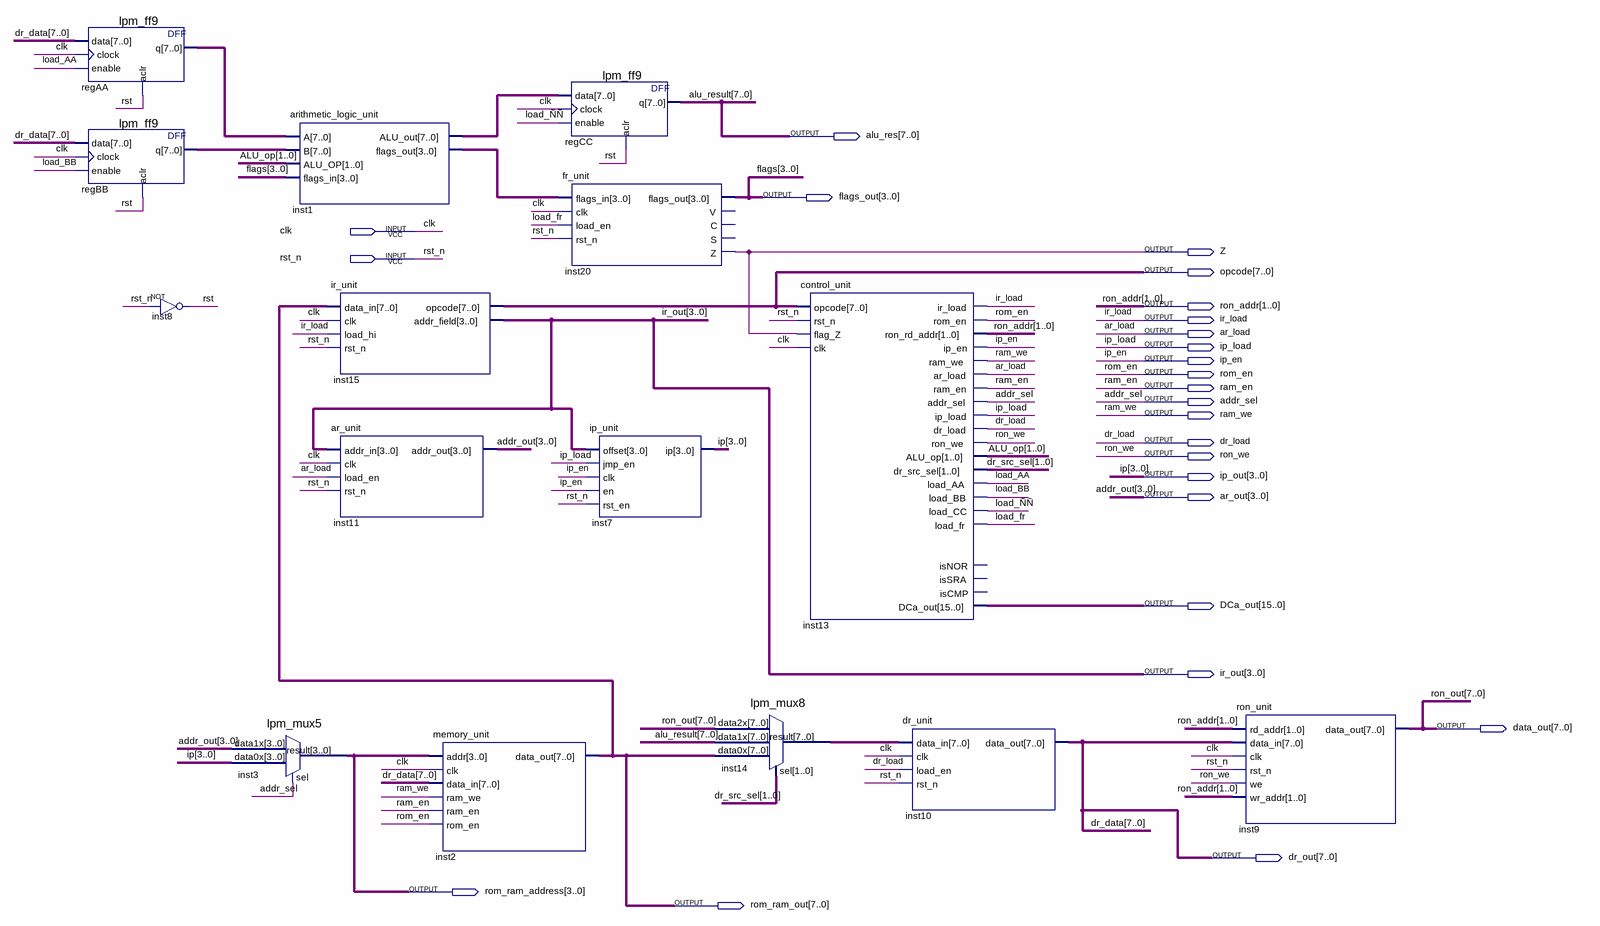
[diagram p0: schematic sheet]
// Quartus schematic lab5_var4_v1.bdf as structural Verilog: 15 symbols, 25 pins
module lab5_var4_v1 (
  input  clk,
  input  rst_n,
  output [7:0] alu_res,
  output [3:0] flags_out,
  output Z,
  output [7:0] opcode,
  output [1:0] ron_addr,
  output ir_load,
  output ar_load,
  output ip_load,
  output ip_en,
  output rom_en,
  output ram_en,
  output addr_sel,
  output ram_we,
  output dr_load,
  output ron_we,
  output [3:0] ip_out,
  output [3:0] ar_out,
  output [15:0] DCa_out,
  output [3:0] ir_out,
  output [7:0] data_out,
  output [7:0] dr_out,
  output [3:0] rom_ram_address,
  output [7:0] rom_ram_out
);

  wire load_AA, load_BB, load_fr, \load_ÑÑ , rst;
  wire [1:0] ALU_op, dr_src_sel;
  wire [3:0] inst1_flags_out;
  wire [7:0] inst1_alu_out, inst14_result, regAA_q, regBB_q;

  lpm_ff9 regAA (.data(dr_out), .clock(clk), .enable(load_AA), .aclr(rst), .q(regAA_q));
  lpm_ff9 regBB (.data(dr_out), .clock(clk), .enable(load_BB), .aclr(rst), .q(regBB_q));
  not inst8 (rst, rst_n);
  lpm_mux5 inst3 (.data1x(ar_out), .data0x(ip_out), .sel(addr_sel), .result(rom_ram_address));
  arithmetic_logic_unit inst1 (
    .A(regAA_q), .B(regBB_q), .ALU_OP(ALU_op), .flags_in(flags_out), .ALU_out(inst1_alu_out),
    .flags_out(inst1_flags_out));
  ir_unit inst15 (
    .data_in(rom_ram_out), .clk(clk), .load_hi(ir_load), .rst_n(rst_n), .opcode(opcode), .addr_field(ir_out));
  ar_unit inst11 (.addr_in(ir_out), .clk(clk), .load_en(ar_load), .rst_n(rst_n), .addr_out(ar_out));
  memory_unit inst2 (
    .addr(rom_ram_address), .clk(clk), .data_in(dr_out), .ram_we(ram_we), .ram_en(ram_en), .rom_en(rom_en),
    .data_out(rom_ram_out));
  lpm_ff9 regCC (.data(inst1_alu_out), .clock(clk), .enable(\load_ÑÑ ), .aclr(rst), .q(alu_res));
  fr_unit inst20 (
    .flags_in(inst1_flags_out), .clk(clk), .load_en(load_fr), .rst_n(rst_n), .flags_out(flags_out), .Z(Z));  // open: V, C, S
  ip_unit inst7 (.offset(ir_out), .jmp_en(ip_load), .clk(ip_en), .en(ip_en), .rst_en(rst_n), .ip(ip_out));
  lpm_mux8 inst14 (.data2x(data_out), .data1x(alu_res), .data0x(rom_ram_out), .sel(dr_src_sel), .result(inst14_result));
  control_unit inst13 (
    .opcode(opcode), .rst_n(rst_n), .flag_Z(Z), .clk(clk), .ir_load(ir_load), .rom_en(rom_en),
    .ron_rd_addr(ron_addr), .ip_en(ip_en), .ram_we(ram_we), .ar_load(ar_load), .ram_en(ram_en),
    .addr_sel(addr_sel), .ip_load(ip_load), .dr_load(dr_load), .ron_we(ron_we), .ALU_op(ALU_op),
    .dr_src_sel(dr_src_sel), .load_AA(load_AA), .load_BB(load_BB), .load_CC(\load_ÑÑ ), .load_fr(load_fr),
    .DCa_out(DCa_out));  // open: isNOR, isSRA, isCMP
  dr_unit inst10 (.data_in(inst14_result), .clk(clk), .load_en(dr_load), .rst_n(rst_n), .data_out(dr_out));
  ron_unit inst9 (
    .rd_addr(ron_addr), .data_in(dr_out), .clk(clk), .rst_n(rst_n), .we(ron_we), .wr_addr(ron_addr),
    .data_out(data_out));

  // Other names for the same wires on the sheet: addr_out[3:0] = ar_out; alu_result[7:0] = alu_res;
  //   dr_data[7:0] = dr_out; flags[3:0] = flags_out; ip[3:0] = ip_out; ron_out[7:0] = data_out
endmodule
